# EAGLE design DFN-8 (EAGLE 9.6.2)
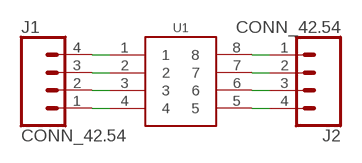
[diagram p0: schematic, sheet 1]

## Parts
J1  CONN_42.54  [1X04]
J2  CONN_42.54  [1X04]
U1  GEN_8DFN  [DFN_8_2.5X2.5]

## Nets
N$1: J1.1 U1.4
N$2: J1.2 U1.3
N$3: J1.3 U1.2
N$4: J1.4 U1.1
N$5: J2.4 U1.5
N$6: J2.3 U1.6
N$7: J2.2 U1.7
N$8: J2.1 U1.8

## Library data of the parts
J1 J2 = bschulz:CONN_4: Genaric 4 terminal header Digikey 2.54_SCREW <https://www.digikey.com/product-detail/en/on-shore-technology-inc/OSTVN04A150/ED10563-ND/1588864>
U1 = bschulz:GEN_8: Generic 8 Pin Package for Breakout Boards

## Board
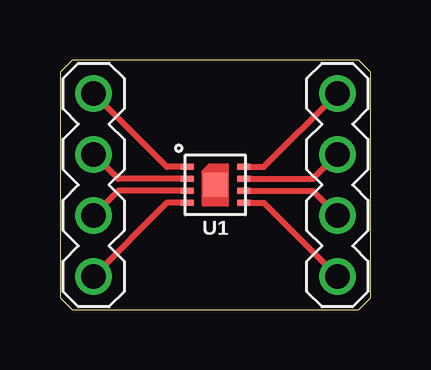
[diagram p1: board, top side]

Size 12.95 x 10.41 mm. Coordinates in mm from the lower left corner, seen from the top.
Outline: 12.95,0.5 12.95,9.91 12.45,10.41 0.5,10.41 0,9.91 0,0.5 0.5,0 12.45,0 12.95,0.5
Copper layers (1*16): Top 0.035559375mm / dielectric 1.6mm / Bottom 0.035559375mm
Design rules "oshpark-2layer": minimum track width 6mil, minimum drill 10mil, track to track 6mil, track to pad 6mil, pad to pad 6mil, via to via 6mil, smd to smd 6mil, copper to edge 15mil, drill to drill 6mil, minimum pad ring 5mil, minimum via ring 5mil, stop-mask expansion 2.5mil, vias tented up to drill 0mil, thermal gap 10mil

### Footprints (pad centres in the part's own frame; a part is rotated, then mirrored left to right if it is on the bottom)
1X04 = drill 1.016: 1 -3.81,0; 2 -1.27,0; 3 1.27,0; 4 3.81,0
DFN_8_2.5X2.5 = smd 0.55 x 0.25: 1 -1.175,0.75; 2 -1.175,0.25; 3 -1.175,-0.25; 4 -1.175,-0.75; 5 1.175,-0.75; 6 1.175,-0.25; 7 1.175,0.25; 8 1.175,0.75 | smd 1 x 1: EP 0,0

### Placement (x,y rotation side)
J1  1.4,5.21 90 top
J2  11.56,5.21 270 top
U1  6.48,5.21 0 top

### Tracks (layer width: path | path; a pad name or v marks a point on that pad's centre or on a via)
N$1
  Top 0.254: U1.4 4.46,4.46 J1.1
N$2
  Top 0.254: U1.3 2.42,4.96 J1.2
N$3
  Top 0.254: U1.2 2.42,5.46 J1.3
N$4
  Top 0.254: U1.1 4.46,5.96 J1.4
N$5
  Top 0.254: U1.5 8.5,4.46 J2.4
N$6
  Top 0.254: U1.6 10.54,4.96 J2.3
N$7
  Top 0.254: U1.7 10.54,5.46 J2.2
N$8
  Top 0.254: U1.8 8.5,5.96 J2.1

### Text on the board
tDocu: 1 | 8 | DFN-8 | 2 | 7 | 3 | 6 | 4 | B. Schulz / Break44 | 5